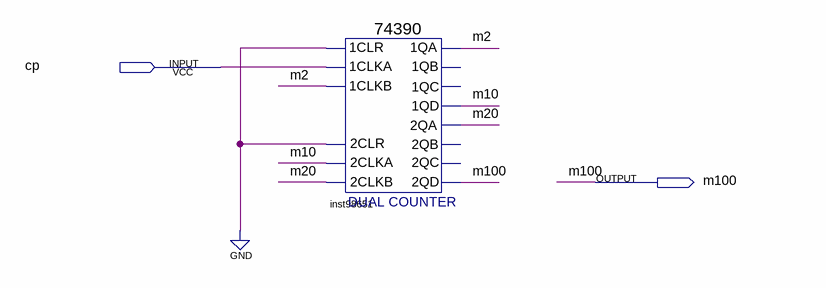
[diagram p0: schematic sheet]
// Quartus schematic m100.bdf as structural Verilog: 1 symbols, 2 pins
module m100 (
  input  cp,
  output m100
);

  wire m2, m10, m20;

  \74390  inst98651 (
    .\2CLKA (m10), .\2CLR (1'b0), .\2CLKB (m20), .\1CLR (1'b0), .\1CLKA (cp), .\1CLKB (m2), .\1QA (m2),
    .\1QD (m10), .\2QA (m20), .\2QD (m100));  // open: 1QB, 1QC, 2QB, 2QC
endmodule
